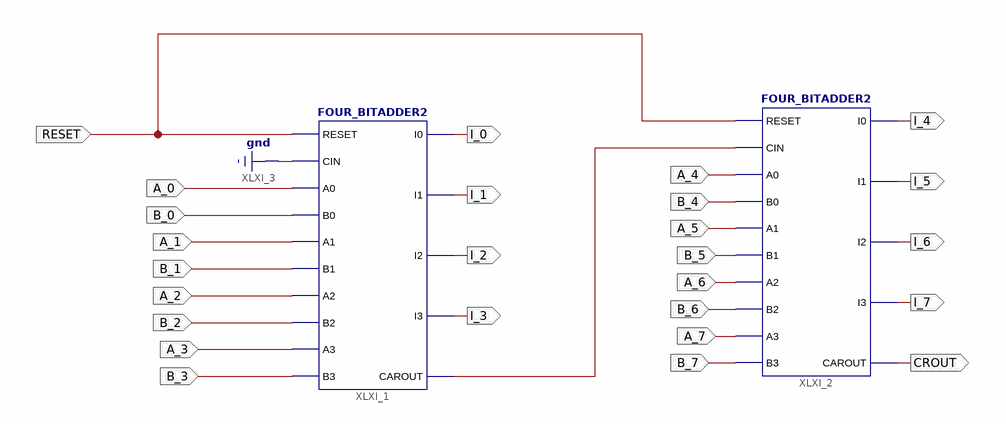
[diagram p0: schematic sheet 1]
// Xilinx ISE schematic EIGHT_BITADDER.sch (artix7) as structural Verilog: 2 symbols, 26 ports
module EIGHT_BITADDER (
  input  RESET,
  input  A_0,
  input  B_0,
  input  A_1,
  input  B_1,
  input  A_2,
  input  B_2,
  input  A_3,
  input  B_3,
  input  A_4,
  input  B_4,
  input  A_5,
  input  B_5,
  input  A_6,
  input  B_6,
  input  A_7,
  input  B_7,
  output I_4,
  output I_5,
  output I_6,
  output I_7,
  output CROUT,
  output I_0,
  output I_1,
  output I_2,
  output I_3
);

  wire XLXN_13;

  FOUR_BITADDER2 XLXI_1 (
    .RESET(RESET), .CIN(1'b0), .A0(A_0), .B0(B_0), .A1(A_1), .B1(B_1), .A2(A_2), .B2(B_2), .A3(A_3),
    .B3(B_3), .I0(I_0), .I1(I_1), .I2(I_2), .I3(I_3), .CAROUT(XLXN_13));
  FOUR_BITADDER2 XLXI_2 (
    .RESET(RESET), .CIN(XLXN_13), .A0(A_4), .B0(B_4), .A1(A_5), .B1(B_5), .A2(A_6), .B2(B_6), .A3(A_7),
    .B3(B_7), .I0(I_4), .I1(I_5), .I2(I_6), .I3(I_7), .CAROUT(CROUT));
endmodule
